# Altium schematic sheet Priorité_batterie.SchDoc: Priorité de batterie
size A4; DrawnBy: Erwan Menard; Revision: V0.2 Rev A; SheetNumber: 4; SheetTotal: 9
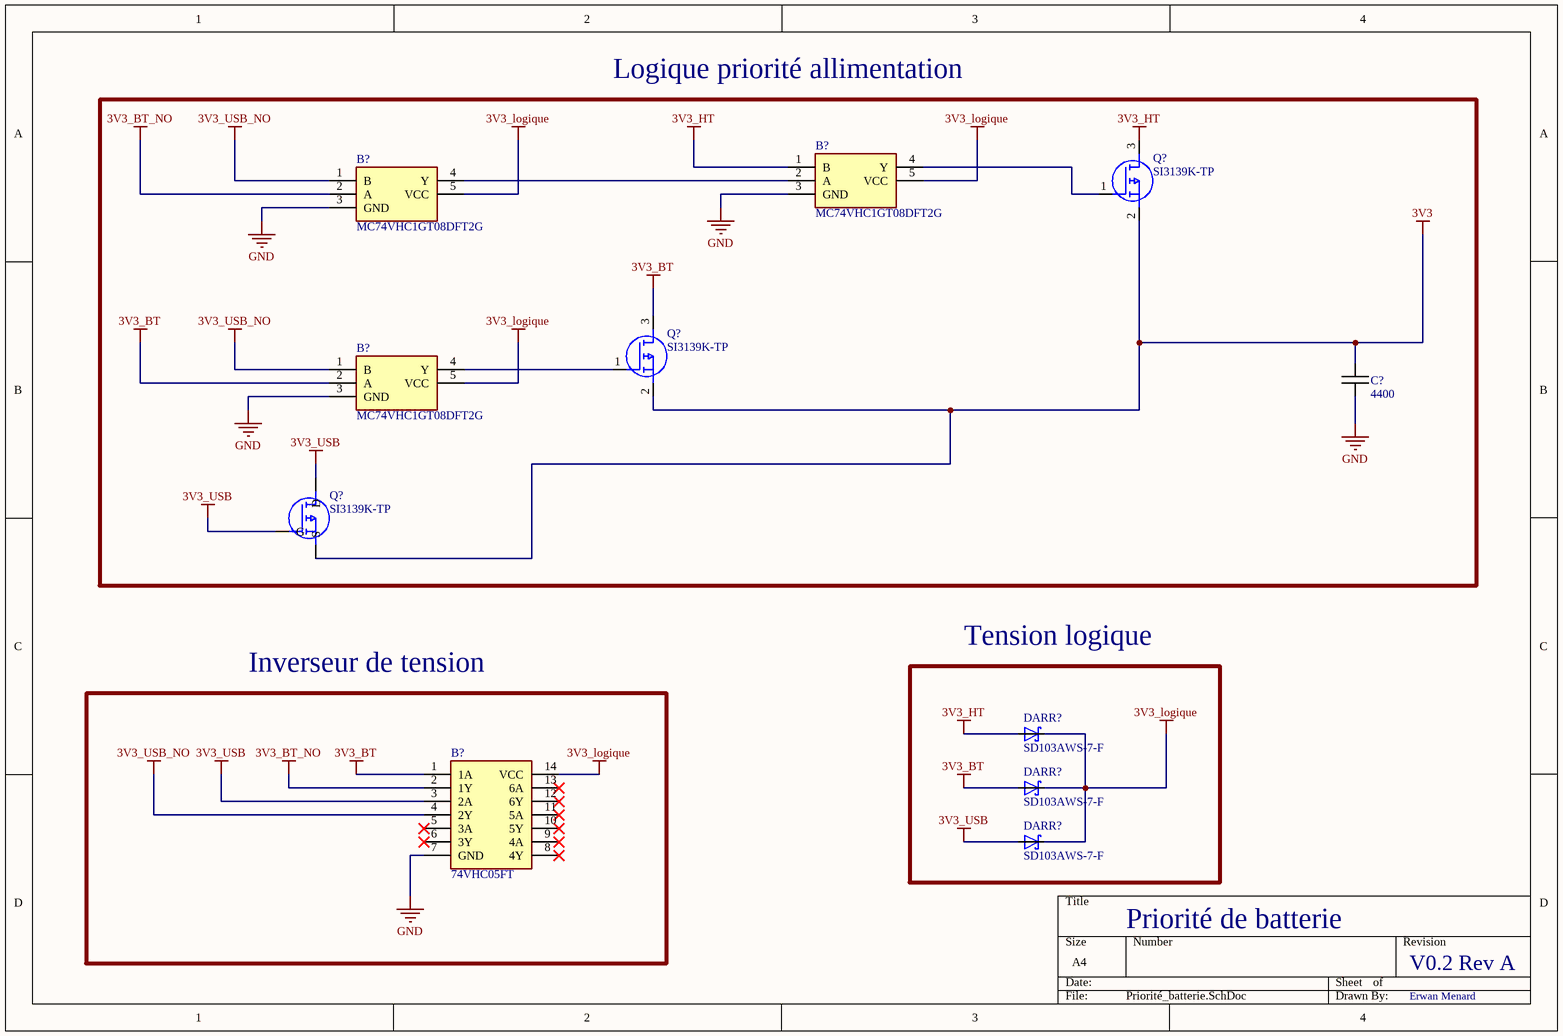
[diagram p0: Priorité_batterie.SchDoc]

## Parts
(Parts that share a designator on the sheet are numbered #1, #2 ... from top to bottom, then left to right.)
B?#1  MC74VHC1GT08DFT2G  [SOT65P210X110-5N]
B?#2  MC74VHC1GT08DFT2G  [SOT65P210X110-5N]
B?#3  MC74VHC1GT08DFT2G  [SOT65P210X110-5N]
B?#4  74VHC05FT  [SOP65P640X120-14N]
C?  4400  [CAPC1005X06N]
DARR?#1  SD103AWS-7-F  [SD103AWS-7-F]
DARR?#2  SD103AWS-7-F  [SD103AWS-7-F]
DARR?#3  SD103AWS-7-F  [SD103AWS-7-F]
Q?#1  SI3139K-TP  [SI3139K-TP]
Q?#2  SI3139K-TP  [SI3139K-TP]
Q?#3  SI3139K-TP  [SI3139K-TP]

## Blocks framed on the sheet
Logique priorité allimentation: B?#1-B?#3 C? Q?#1-Q?#3
Tension logique: DARR?#1-DARR?#3
Inverseur de tension: B?#4

## Nets
3V3: C?.1 Q?#1.2(S) Q?#2.2(S) Q?#3.2(S)
3V3_BT: B?#3.2(A) B?#4.1(1A) DARR?#2.2(A) Q?#2.3(D)
3V3_BT_NO: B?#2.2(A) B?#4.2(1Y)
3V3_HT: B?#1.1(B) DARR?#1.2(A) Q?#1.3(D)
3V3_logique: B?#1.5(VCC) B?#2.5(VCC) B?#3.5(VCC) B?#4.14(VCC) DARR?#1.1(C) DARR?#2.1(C) DARR?#3.1(C)
3V3_USB: B?#4.3(2A) DARR?#3.2(A) Q?#3.1(G) Q?#3.3(D)
3V3_USB_NO: B?#2.1(B) B?#3.1(B) B?#4.4(2Y)
GND: B?#1.3(GND) B?#2.3(GND) B?#3.3(GND) B?#4.7(GND) C?.2
NetB?#1_2: B?#1.2(A) B?#2.4(Y)
NetB?#1_4: B?#1.4(Y) Q?#1.1(G)
NetB?#3_4: B?#3.4(Y) Q?#2.1(G)

Not connected (* = marked no-connect by the designer): B?#4 5(3A)* 6(3Y)* 8(4Y)* 9(4A)* 10(5Y)* 11(5A)* 12(6Y)* 13(6A)*

## Library data of the parts
B?#1-B?#3 = MC74VHC1GT08DFT2G: Single 2-Input AND Gate, TTL Level; Manufacturer_Name: onsemi; Manufacturer_Part_Number: MC74VHC1GT08DFT2G; Parameter 3: *
B?#4 = 74VHC05FT: Logic Gates CMOS LOGIC IC INVERTER; Manufacturer_Name: Toshiba; Manufacturer_Part_Number: 74VHC05FT; Mouser Part Number: 757-74VHC05FT
C? = Capacitor
DARR?#1-DARR?#3 = SD103AWS-7-F: Diode Array 3 Independent Schottky 40V 175mA Surface Mount 6-TSSOP, SC-88, SOT-363
Q?#1-Q?#3 = SI3139K-TP: MOSFET P-Channel MOSFET